# EAGLE design untitled (EAGLE 7.2.0)
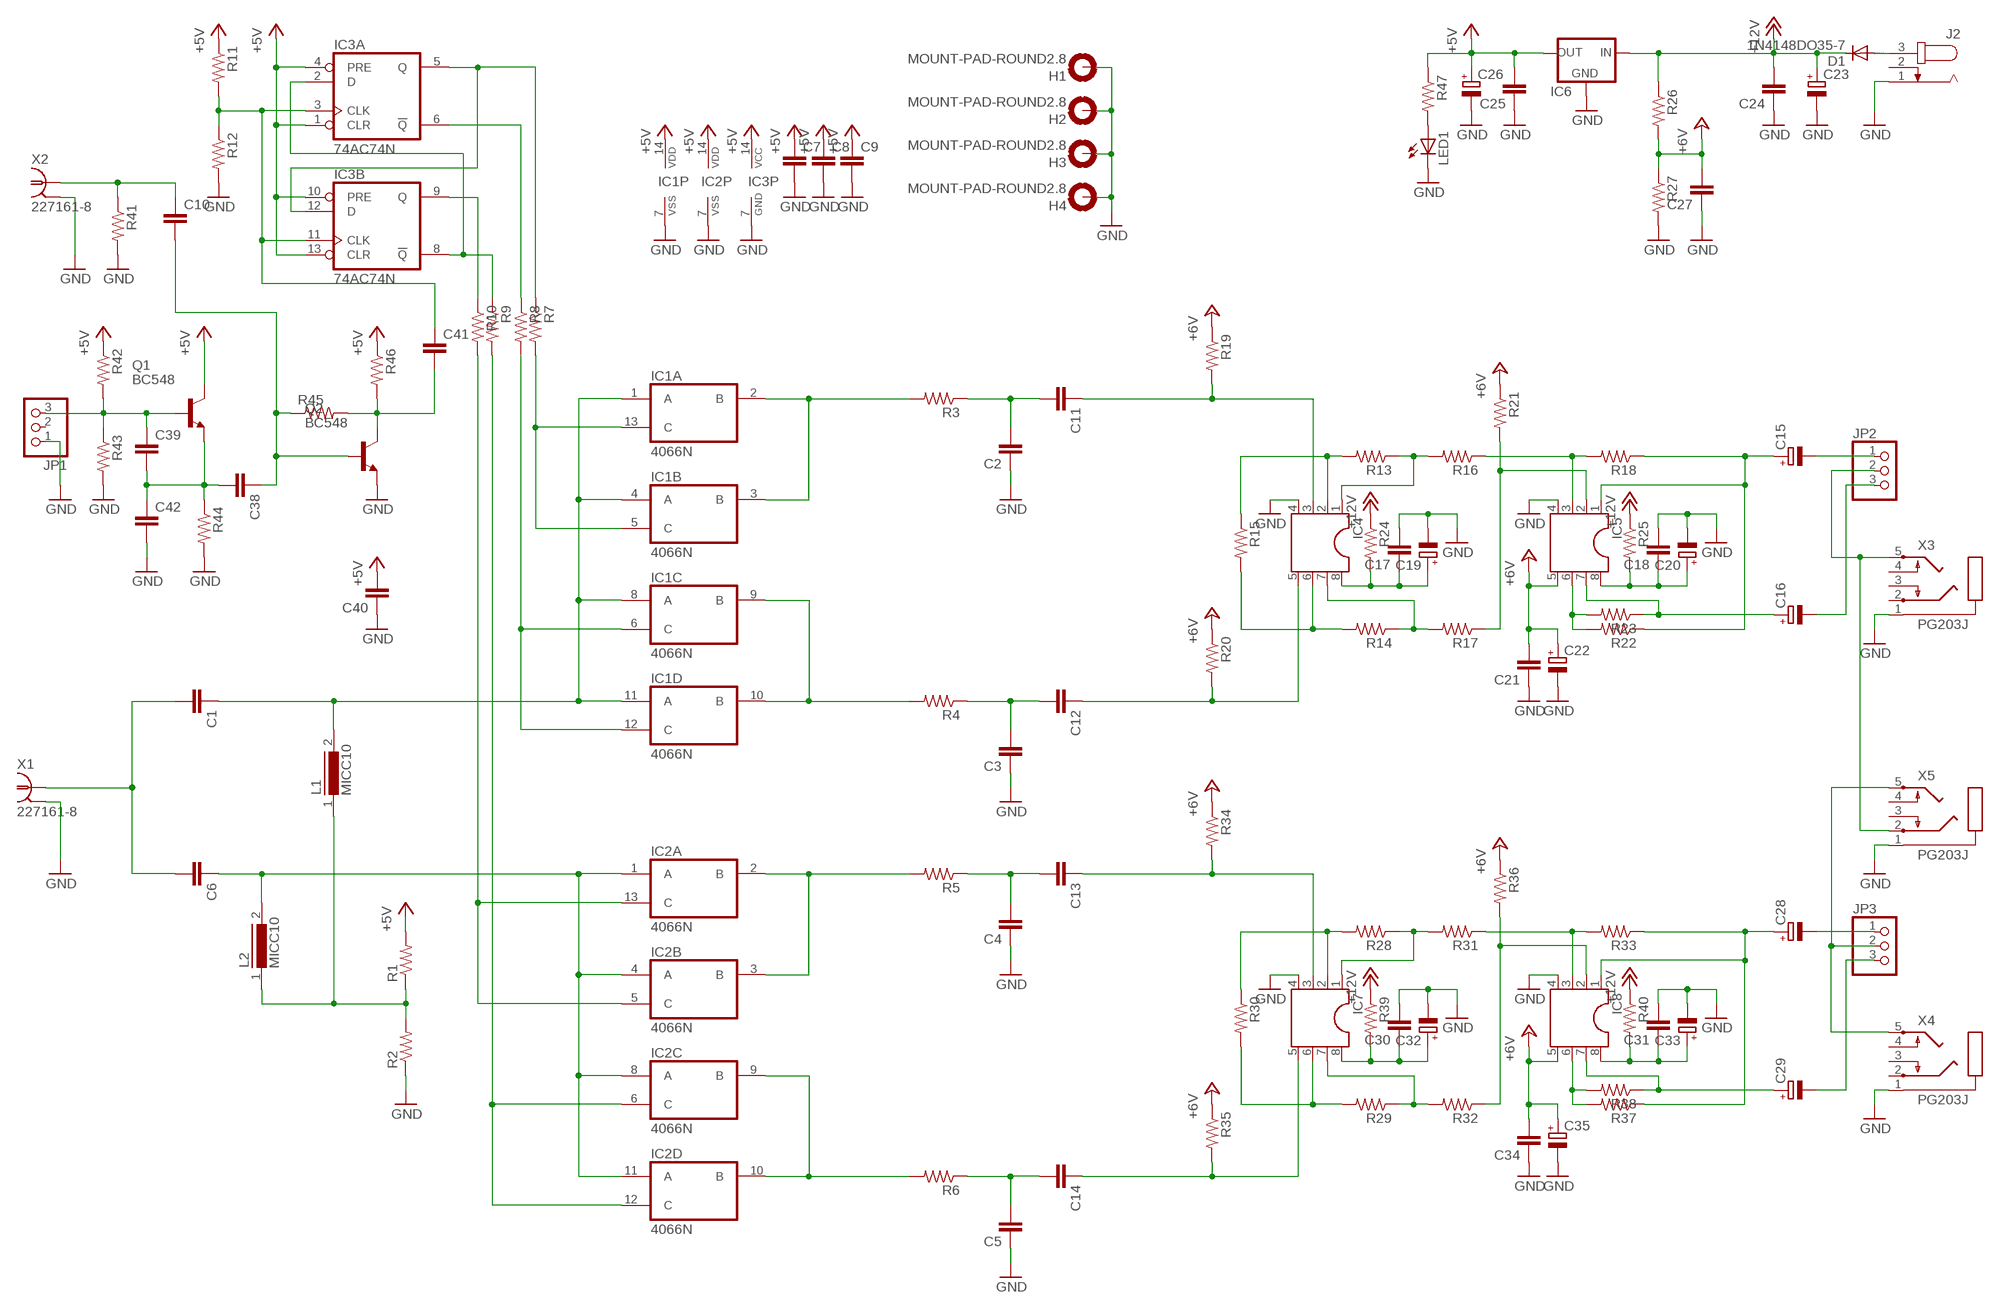
[diagram p0: schematic, sheet 1]

## Parts
C1  C-EU050-025X075  [C050-025X075]
C2  C-EU050-025X075  [C050-025X075]
C3  C-EU050-025X075  [C050-025X075]
C4  C-EU050-025X075  [C050-025X075]
C5  C-EU050-025X075  [C050-025X075]
C6  C-EU050-025X075  [C050-025X075]
C7  C-EU050-025X075  [C050-025X075]
C8  C-EU050-025X075  [C050-025X075]
C9  C-EU050-025X075  [C050-025X075]
C10  C-EU050-025X075  [C050-025X075]
C11  C-EU050-025X075  [C050-025X075]
C12  C-EU050-025X075  [C050-025X075]
C13  C-EU050-025X075  [C050-025X075]
C14  C-EU050-025X075  [C050-025X075]
C15  CPOL-EUE5-6  [E5-6]
C16  CPOL-EUE5-6  [E5-6]
C17  C-EU050-025X075  [C050-025X075]
C18  C-EU050-025X075  [C050-025X075]
C19  CPOL-EUE5-6  [E5-6]
C20  CPOL-EUE5-6  [E5-6]
C21  C-EU050-025X075  [C050-025X075]
C22  CPOL-EUE5-6  [E5-6]
C23  CPOL-EUE5-6  [E5-6]
C24  C-EU050-025X075  [C050-025X075]
C25  C-EU050-025X075  [C050-025X075]
C26  CPOL-EUE5-6  [E5-6]
C27  C-EU050-025X075  [C050-025X075]
C28  CPOL-EUE5-6  [E5-6]
C29  CPOL-EUE5-6  [E5-6]
C30  C-EU050-025X075  [C050-025X075]
C31  C-EU050-025X075  [C050-025X075]
C32  CPOL-EUE5-6  [E5-6]
C33  CPOL-EUE5-6  [E5-6]
C34  C-EU050-025X075  [C050-025X075]
C35  CPOL-EUE5-6  [E5-6]
C38  C-EU050-025X075  [C050-025X075]
C39  C-EU025-025X050  [C025-025X050]
C40  C-EU050-025X075  [C050-025X075]
C41  C-EU075-032X103  [C075-032X103]
C42  C-EU025-025X050  [C025-025X050]
D1  1N4148DO35-7  [DO35-7]
H1  MOUNT-PAD-ROUND2.8  [2,8-PAD]
H2  MOUNT-PAD-ROUND2.8  [2,8-PAD]
H3  MOUNT-PAD-ROUND2.8  [2,8-PAD]
H4  MOUNT-PAD-ROUND2.8  [2,8-PAD]
IC1  4066N  [DIL14]
IC2  4066N  [DIL14]
IC3  74AC74N  [DIL14]
IC4  DIL8  [DIL08]
IC5  DIL8  [DIL08]
IC6  78XXS  [78XXS]
IC7  DIL8  [DIL08]
IC8  DIL8  [DIL08]
J2  JACK-PLUG0  [SPC4077]
JP1  PINHD-1X3  [1X03]
JP2  PINHD-1X3  [1X03]
JP3  PINHD-1X3  [1X03]
L1  MICC10  [MICC10]
L2  MICC10  [MICC10]
LED1  LED3MM  [LED3MM]
Q1  BC548  [TO92-EBC]
Q2  BC548  [TO92-EBC]
R1  R-US_0207/7  [0207/7]
R2  R-US_0207/7  [0207/7]
R3  R-US_0207/7  [0207/7]
R4  R-US_0207/7  [0207/7]
R5  R-US_0207/7  [0207/7]
R6  R-US_0207/7  [0207/7]
R7  R-US_0207/7  [0207/7]
R8  R-US_0207/7  [0207/7]
R9  R-US_0207/7  [0207/7]
R10  R-US_0207/7  [0207/7]
R11  R-US_0207/7  [0207/7]
R12  R-US_0207/7  [0207/7]
R13  R-US_0207/7  [0207/7]
R14  R-US_0207/7  [0207/7]
R15  R-US_0207/7  [0207/7]
R16  R-US_0207/7  [0207/7]
R17  R-US_0207/7  [0207/7]
R18  R-US_0207/7  [0207/7]
R19  R-US_0207/7  [0207/7]
R20  R-US_0207/7  [0207/7]
R21  R-US_0207/7  [0207/7]
R22  R-US_0207/7  [0207/7]
R23  R-US_0207/7  [0207/7]
R24  R-US_0207/7  [0207/7]
R25  R-US_0207/7  [0207/7]
R26  R-US_0207/7  [0207/7]
R27  R-US_0207/7  [0207/7]
R28  R-US_0207/7  [0207/7]
R29  R-US_0207/7  [0207/7]
R30  R-US_0207/7  [0207/7]
R31  R-US_0207/7  [0207/7]
R32  R-US_0207/7  [0207/7]
R33  R-US_0207/7  [0207/7]
R34  R-US_0207/7  [0207/7]
R35  R-US_0207/7  [0207/7]
R36  R-US_0207/7  [0207/7]
R37  R-US_0207/7  [0207/7]
R38  R-US_0207/7  [0207/7]
R39  R-US_0207/7  [0207/7]
R40  R-US_0207/7  [0207/7]
R41  R-US_0207/7  [0207/7]
R42  R-US_0207/7  [0207/7]
R43  R-US_0207/7  [0207/7]
R44  R-US_0207/7  [0207/7]
R45  R-US_0207/7  [0207/7]
R46  R-US_0207/7  [0207/7]
R47  R-US_0207/7  [0207/7]
X1  227161-8  [AMP_227161]
X2  227161-8  [AMP_227161]
X3  PG203J  [PG203J]
X4  PG203J  [PG203J]
X5  PG203J  [PG203J]

## Nets
+5V: C7.1 C8.1 C9.1 C25.2 C26.+ C40.2 IC1.14(P:VDD) IC2.14(P:VDD) IC3.1(A:CLR) IC3.4(A:PRE) IC3.10(B:PRE) IC3.13(B:CLR) IC3.14(P:VCC) IC6.OUT Q1.C R1.2 R11.1 R42.1 R46.1 R47.1
+12V: C23.+ C24.2 D1.C IC6.IN R24.1 R25.1 R26.1 R39.1 R40.1
+24V: C21.2 C22.+ C27.2 C34.2 C35.+ IC5.5 IC8.5 R19.1 R20.1 R21.1 R26.2 R27.1 R34.1 R35.1 R36.1 ; supply symbol labelled +6V
GND: C2.1 C3.1 C4.1 C5.1 C7.2 C8.2 C9.2 C17.2 C18.2 C19.- C20.- C21.1 C22.- C23.- C24.1 C25.1 C26.- C27.1 C30.2 C31.2 C32.- C33.- C34.1 C35.- C40.1 C42.2 H1.B2,8(MOUNT) H2.B2,8(MOUNT) H3.B2,8(MOUNT) H4.B2,8(MOUNT) IC1.7(P:VSS) IC2.7(P:VSS) IC3.7(P:GND) IC4.4 IC5.4 IC6.GND IC7.4 IC8.4 J2.1 JP1.1 LED1.K(C) Q2.E R2.1 R12.2 R27.2 R41.2 R43.2 R44.2 X1.2 X2.2 X3.1 X4.1 X5.1
N$1: L1.1 L2.1 R1.1 R2.2
N$2: C1.2 C6.2 X1.1
N$3: C1.1 IC1.1(A:A) IC1.4(B:A) IC1.8(C:A) IC1.11(D:A) L1.2
N$4: C6.1 IC2.1(A:A) IC2.4(B:A) IC2.8(C:A) IC2.11(D:A) L2.2
N$5: IC1.9(C:B) IC1.10(D:B) R4.2
N$6: IC1.2(A:B) IC1.3(B:B) R3.2
N$7: IC2.2(A:B) IC2.3(B:B) R5.2
N$8: IC2.9(C:B) IC2.10(D:B) R6.2
N$9: IC1.5(B:C) IC1.13(A:C) R7.2
N$10: IC1.6(C:C) IC1.12(D:C) R8.2
N$11: IC2.5(B:C) IC2.13(A:C) R10.2
N$12: IC2.6(C:C) IC2.12(D:C) R9.2
N$13: C2.2 C11.2 R3.1
N$14: C3.2 C12.2 R4.1
N$15: C4.2 C13.2 R5.1
N$16: C5.2 C14.2 R6.1
N$17: IC3.2(A:D) IC3.8(B:!Q) R9.1
N$18: IC3.6(A:!Q) R8.1
N$19: IC3.5(A:Q) IC3.12(B:D) R7.1
N$20: IC3.9(B:Q) R10.1
N$21: C41.1 IC3.3(A:CLK) IC3.11(B:CLK) R11.2 R12.1
N$22: C11.1 IC4.3 R19.2
N$23: C12.1 IC4.5 R20.2
N$24: IC4.2 R13.2 R15.1
N$25: IC4.6 R14.2 R15.2
N$26: IC4.7 R14.1 R17.2
N$27: IC4.1 R13.1 R16.2
N$28: IC5.2 R17.1 R21.2
N$29: C15.+ IC5.1 R18.1 R22.1
N$30: IC5.3 R16.1 R18.2
N$31: IC5.6 R22.2 R23.2
N$32: C16.+ IC5.7 R23.1
N$33: C17.1 C19.+ IC4.8 R24.2
N$34: C18.1 C20.+ IC5.8 R25.2
N$35: D1.A J2.3
N$36: C10.1 R41.1 X2.1
N$37: C15.- JP2.1
N$38: C13.1 IC7.3 R34.2
N$39: C14.1 IC7.5 R35.2
N$40: IC7.2 R28.2 R30.1
N$41: IC7.6 R29.2 R30.2
N$42: IC7.7 R29.1 R32.2
N$43: IC7.1 R28.1 R31.2
N$44: IC8.3 R31.1 R33.2
N$45: IC8.2 R32.1 R36.2
N$46: C28.+ IC8.1 R33.1 R37.1
N$47: IC8.6 R37.2 R38.2
N$48: C29.+ IC8.7 R38.1
N$49: C30.1 C32.+ IC7.8 R39.2
N$50: C31.1 C33.+ IC8.8 R40.2
N$51: C16.- JP2.3
N$52: C28.- JP3.1
N$53: C29.- JP3.3
N$54: C39.1 JP1.3 Q1.B R42.2 R43.1
N$55: C38.2 C39.2 C42.1 Q1.E R44.1
N$56: JP2.2 X3.5 X5.2
N$57: C41.2 Q2.C R45.2 R46.2
N$58: C10.2 C38.1 Q2.B R45.1
N$59: LED1.A R47.2
N$60: JP3.2 X4.5 X5.5
Unconnected: J2.2 JP1.2 X3.2 X3.3 X3.4 X4.2 X4.3 X4.4 X5.3 X5.4

## Library data of the parts
C1-C14 C17 C18 C21 C24 C25 C27 C30 C31 C34 C38-C42 = rcl:C-EU: CAPACITOR, European symbol
C15 C16 C19 C20 C22 C23 C26 C28 C29 C32 C33 C35 = rcl:CPOL-EU: POLARIZED CAPACITOR, European symbol
D1 = diode:1N4148: DIODE high speed (Philips)
H1-H4 = holes:MOUNT-PAD-ROUND: MOUNTING PAD, round
IC1 IC2 = 40xx:4066: Quad bilateral ANALOG SWITCH
IC3 = 74xx-eu:74*74: Dual D type positive edge triggered FLIP FLOP, preset and clear
IC4 IC5 IC7 IC8 = ic-package:DIL8: Dual In Line / Socket
IC6 = v-reg:78XXS: VOLTAGE REGULATOR
J2 = con-jack:JACK-PLUG: DC POWER JACK Power Jack, DC, Right Angle, Through Hole, Rated 5A at 16VDC, PC Terminals Distributor: Farnell (www.Farnell.de) Drawing: 84N1161.pdf / 84N1162.pdf Manufacturer: SPC Technology (www.spctechnology.com) Type: SPC4077 / SPC 4078; OC_FARNELL: unknown; OC_NEWARK: unknown
JP1-JP3 = pinhead:PINHD-1X3: PIN HEADER
L1 L2 = inductors:MICC10: INDUCTOR
LED1 = led:LED: LED OSRAM: - CHIPLED LG R971, LG N971, LY N971, LG Q971, LY Q971, LO R971, LY R971 LH N974, LH R974 LS Q976, LO Q976, LY Q976 LO Q996 - Hyper CHIPLED LW Q18S LB Q993, LB Q99A, LB R99A - SideLED LS A670, LO A670, LY A670, LG A670, LP A670 LB A673, LV A673, LT A673, LW A673 LH A674 LY A675 LS A676, LA A676, LO A676, LY A676, LW A676 LS A679, LY A679, LG A679 - Hyper Micro SIDELED® LS Y876, LA Y876, LO Y876, LY Y876 LT Y87S - SmartLED LW L88C, LW L88S LB L89C, LB L89S, LG L890 LS L89K, LO L89K, LY L89K LS L896, LA L896, LO L896, LY L896 - TOPLED LS T670, LO T670, LY T670, LG T670, LP T670 LSG T670, LSP T670, LSY T670, LOP T670, LYG T670 LG T671, LOG T671, LSG T671 LB T673, LV T673, LT T673, LW T673 LH T674 LS T676, LA T676, LO T676, LY T676, LB T676, LH T676, LSB T676, LW T676 LB T67C, LV T67C, LT T67C, LS T67K, LO T67K, LY T67K, LW E67C LS E67B, LA E67B, LO E67B, LY E67B, LB E67C, LV E67C, LT E67C LW T67C LS T679, LY T679, LG T679 LS T770, LO T770, LY T770, LG T770, LP T770 LB T773, LV T773, LT T773, LW T773 LH T774 LS E675, LA E675, LY E675, LS T675 LS T776, LA T776, LO T776, LY T776, LB T776 LHGB T686 LT T68C, LB T68C - Hyper Mini TOPLED® LB M676 - Mini TOPLED Santana® LG M470 LS M47K, LO M47K, LY M47K Source: http://www.osram.convergy.de LUXEON: - LUMILED® LXK2-PW12-R00, LXK2-PW12-S00, LXK2-PW14-U00, LXK2-PW14-V00 LXK2-PM12-R00, LXK2-PM12-S00, LXK2-PM14-U00 LXK2-PE12-Q00, LXK2-PE12-R00, LXK2-PE12-S00, LXK2-PE14-T00, LXK2-PE14-U00 LXK2-PB12-K00, LXK2-PB12-L00, LXK2-PB12-M00, LXK2-PB14-N00, LXK2-PB14-P00, LXK2-PB14-Q00 LXK2-PR12-L00, LXK2-PR12-M00, LXK2-PR14-Q00, LXK2-PR14-R00 LXK2-PD12-Q00, LXK2-PD12-R00, LXK2-PD12-S00 LXK2-PH12-R00, LXK2-PH12-S00 LXK2-PL12-P00, LXK2-PL12-Q00, LXK2-PL12-R00 Source: www.luxeon.com KINGBRIGHT: KA-3528ASYC Source: www.kingbright.com
Q1 Q2 = transistor-npn:BC548*: NPN Transistor
R1-R47 = rcl:R-US_: RESISTOR, American symbol
X1 X2 = con-coax:?227161*: JACK, RIGHT ANGLE, 50 OHM, PCB, BNC Source: amp_227161.pdf; OC_FARNELL: unknown; OC_NEWARK: unknown
X3-X5 = con-hirschmann:PG203J: MIC/HEADPHONE JACK KS-S stereo microphone/headphone jack PG203JN (Schukat); OC_FARNELL: unknown; OC_NEWARK: unknown

## Board
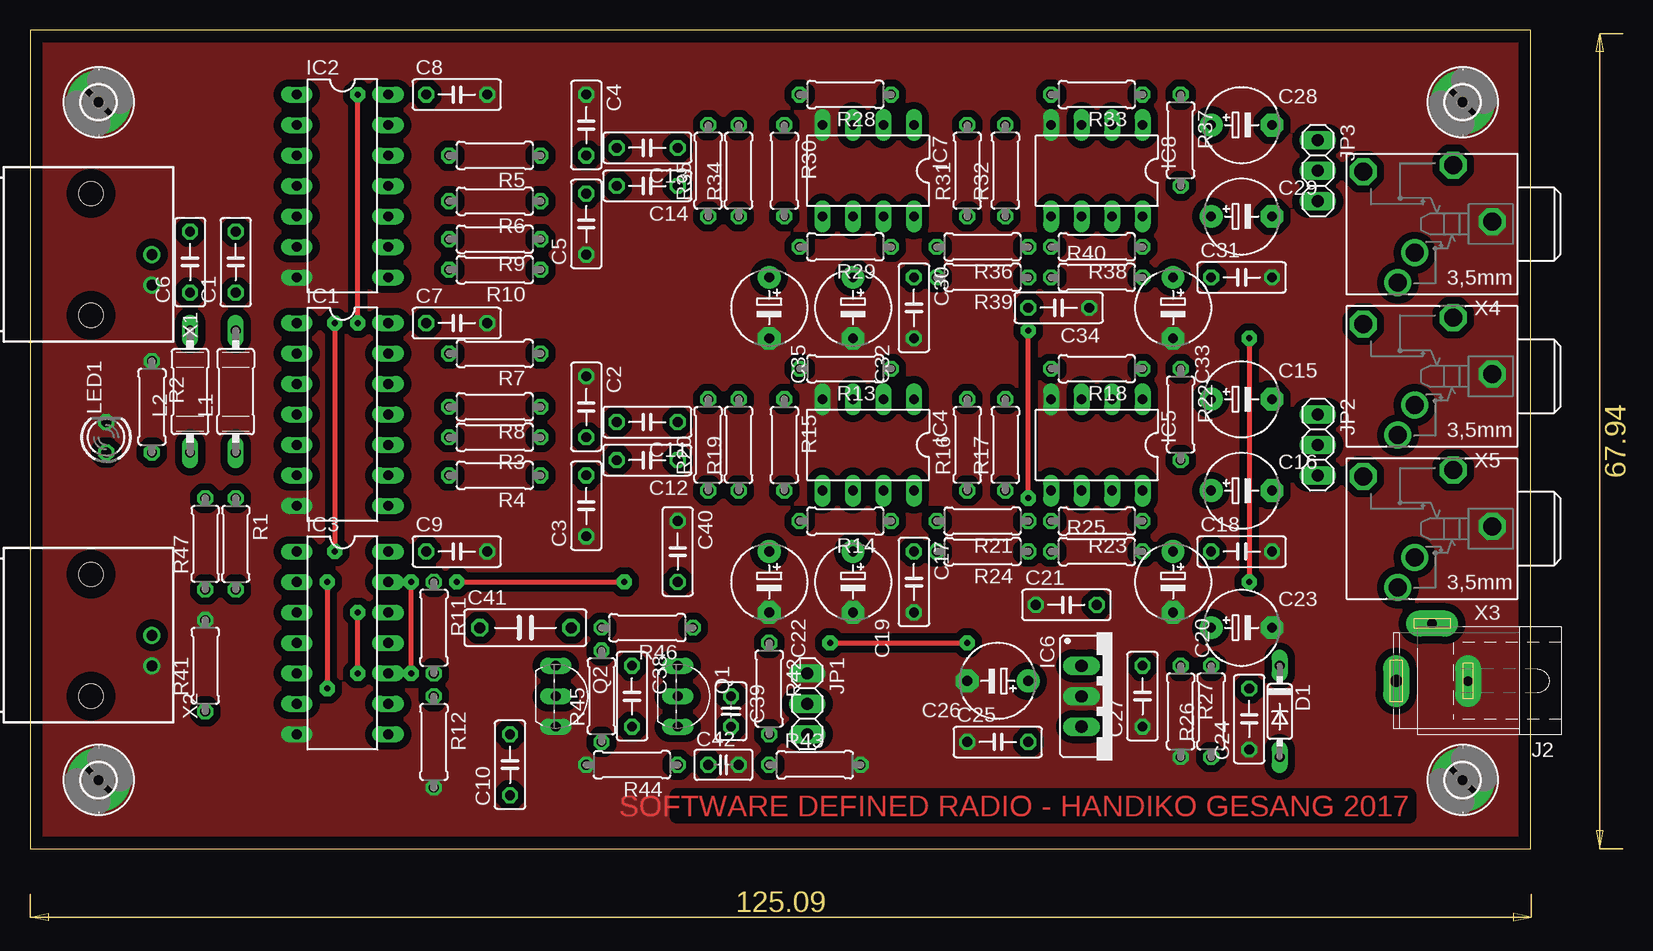
[diagram p1: board, top side]
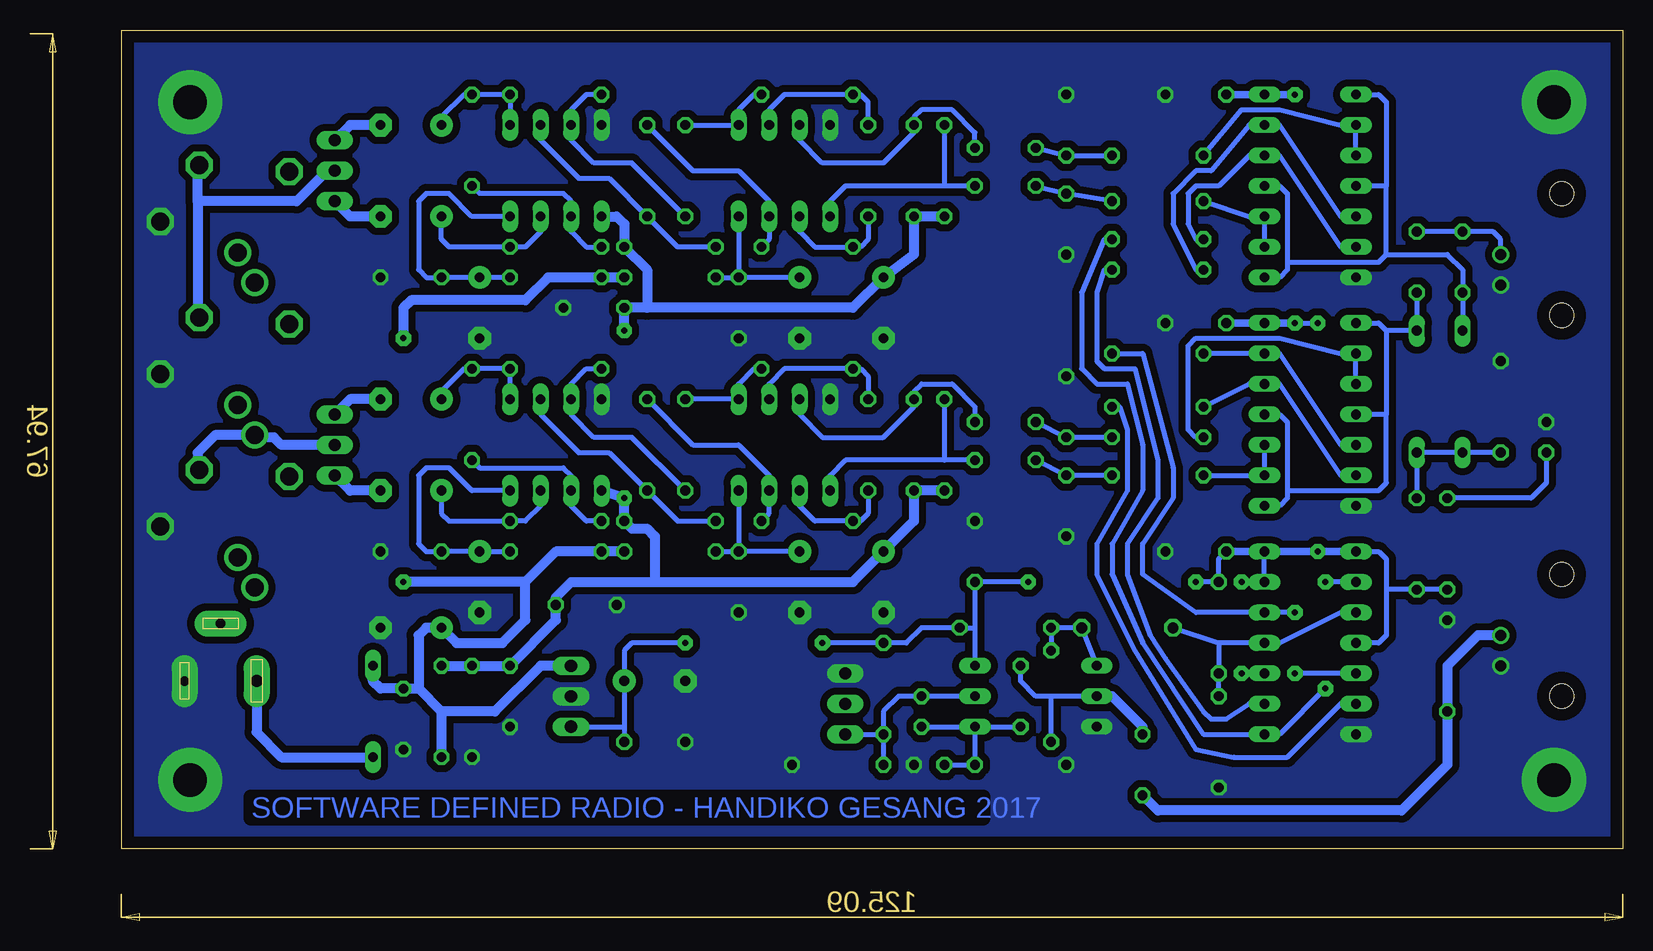
[diagram p2: board, bottom side, seen from below]

Size 125.08 x 68.25 mm. Coordinates in mm from the lower left corner, seen from the top.
Outline: 0,0 125.08,0 125.08,68.25 0,68.25 0,0
Copper layers (1*16): Top 0.035mm / dielectric 1.5mm / Bottom 0.035mm
Design rules "default *": minimum track width 10mil, minimum drill 10mil, track to track 8mil, track to pad 8mil, pad to pad 8mil, via to via 8mil, smd to smd 8mil, copper to edge 40mil, drill to drill 8mil, minimum pad ring 10mil, minimum via ring 10mil, stop-mask expansion 4mil, vias tented up to drill 0mil, thermal gap 10mil

### Footprints (pad centres in the part's own frame; a part is rotated, then mirrored left to right if it is on the bottom)
C050-025X075 = drill 0.813 octagon: 1 -2.54,0; 2 2.54,0
E5-6 = drill 0.813 pad 1.905: + -2.54,0 | drill 0.813 pad 1.905 octagon: - 2.54,0
C025-025X050 = drill 0.813 octagon: 1 -1.27,0; 2 1.27,0
C075-032X103 = drill 0.914 octagon: 1 -3.81,0; 2 3.81,0
DO35-7 = drill 0.813 long: A 3.81,0; C -3.81,0
2,8-PAD = drill 2.8 pad 5.334: B2,8 0,0
DIL14 = drill 0.813 long: 1 -7.62,-3.81; 2 -5.08,-3.81; 3 -2.54,-3.81; 4 0,-3.81; 5 2.54,-3.81; 6 5.08,-3.81; 7 7.62,-3.81; 8 7.62,3.81; 9 5.08,3.81; 10 2.54,3.81; 11 0,3.81; 12 -2.54,3.81; 13 -5.08,3.81; 14 -7.62,3.81
DIL08 = drill 0.813 long: 1 -3.81,-3.81; 2 -1.27,-3.81; 3 1.27,-3.81; 4 3.81,-3.81; 5 3.81,3.81; 6 1.27,3.81; 7 -1.27,3.81; 8 -3.81,3.81
78XXS = drill 1.016 long: GND 0,-2.54; IN -2.54,-2.54; OUT 2.54,-2.54
SPC4077 = drill 0.8 pad 2.184 long: 1 -3,0; 2 0,-4.8 | drill 1 pad 2.184 long: 3 3,0
1X03 = drill 1.016 long: 1 -2.54,0; 2 0,0; 3 2.54,0
MICC10 = drill 0.813 long: 1 -5.08,0; 2 5.08,0
LED3MM = drill 0.813 octagon: A -1.27,0; K 1.27,0
TO92-EBC = drill 0.813 long: B 0,-1.27; C -2.54,-1.27; E 2.54,-1.27
0207/7 = drill 0.813 octagon: 1 -3.81,0; 2 3.81,0
AMP_227161 = drill 0.9 pad 1.27: 1 0,-5.08; 2 -2.54,-5.08 | hole 2: -5.08,0; 5.08,0
PG203J = drill 1.499 octagon: 1 -5.004,-0.203; 4 5.74,-4.369; 5 -1.753,-4.902 | drill 1.499: 2 2.845,4.902; 3 1.448,2.388

### Placement (x,y rotation side)
C1  17.14,48.9 90 top
C2  46.35,36.83 270 top
C3  46.35,28.57 90 top
C4  46.35,60.33 270 top
C5  46.35,52.07 90 top
C6  13.34,48.9 90 top
C7  35.56,43.81 0 top
C8  35.56,62.87 0 top
C9  35.56,24.77 0 top
C10  40.01,6.99 90 top
C11  51.44,35.56 180 top
C12  51.44,32.38 180 top
C13  51.44,58.42 180 top
C14  51.44,55.24 180 top
C15  100.97,37.47 0 top
C16  100.97,29.84 0 top
C17  73.66,22.23 270 top
C18  100.97,24.77 0 top
C19  68.58,22.23 270 top
C20  95.25,22.23 270 top
C21  86.36,20.32 0 top
C22  61.59,22.23 270 top
C23  100.97,18.41 0 top
C24  101.6,10.79 90 top
C25  80.64,8.89 0 top
C26  80.64,13.97 180 top
C27  92.71,12.7 90 top
C28  100.97,60.33 0 top
C29  100.97,52.7 0 top
C30  73.66,45.09 270 top
C31  100.97,47.62 0 top
C32  68.58,45.09 270 top
C33  95.25,45.09 270 top
C34  85.72,45.09 180 top
C35  61.59,45.09 270 top
C38  50.16,12.7 270 top
C39  58.42,11.43 270 top
C40  53.98,24.77 270 top
C41  41.27,18.41 0 top
C42  57.78,6.99 0 top
D1  104.14,11.43 270 top
H1  119.38,5.71 0 top
H2  5.71,5.71 0 top
H3  5.71,62.23 0 top
H4  119.38,62.23 0 top
IC1  26.04,36.2 270 top
IC2  26.04,55.24 270 top
IC3  26.04,17.14 270 top
IC4  69.85,33.66 180 top
IC5  88.9,33.66 180 top
IC6  90.17,12.7 270 top
IC7  69.85,56.52 180 top
IC8  88.9,56.52 180 top
J2  116.84,13.97 180 top
JP1  64.77,12.06 270 top
JP2  107.31,33.66 270 top
JP3  107.31,56.52 270 top
L1  17.14,38.1 90 top
L2  13.34,38.1 90 top
LED1  6.35,34.29 90 top
Q1  55.24,12.7 270 top
Q2  45.09,12.7 270 top
R1  17.14,25.4 270 top
R2  10.16,36.83 270 top
R3  38.73,34.29 180 top
R4  38.73,31.11 180 top
R5  38.73,57.78 180 top
R6  38.73,53.98 180 top
R7  38.73,41.27 180 top
R8  38.73,36.83 180 top
R9  38.73,50.8 180 top
R10  38.73,48.26 180 top
R11  33.66,18.41 270 top
R12  33.66,8.89 270 top
R13  67.94,40.01 180 top
R14  67.94,27.3 180 top
R15  62.87,33.66 270 top
R16  78.11,33.66 90 top
R17  81.28,33.66 90 top
R18  88.9,40.01 180 top
R19  59.05,33.66 90 top
R20  56.52,33.66 90 top
R21  79.38,27.3 180 top
R22  95.89,36.2 270 top
R23  88.9,27.3 180 top
R24  79.38,24.77 180 top
R25  88.9,24.77 0 top
R26  98.42,11.43 90 top
R27  95.89,11.43 270 top
R28  67.94,62.87 180 top
R29  67.94,50.16 180 top
R30  62.87,56.52 270 top
R31  78.11,56.52 90 top
R32  81.28,56.52 90 top
R33  88.9,62.87 180 top
R34  59.05,56.52 90 top
R35  56.52,56.52 90 top
R36  79.38,50.16 180 top
R37  95.89,59.05 270 top
R38  88.9,50.16 180 top
R39  79.38,47.62 180 top
R40  88.9,47.62 0 top
R41  14.61,15.24 90 top
R42  61.59,13.34 270 top
R43  65.41,6.99 0 top
R44  50.16,6.99 180 top
R45  47.62,12.7 90 top
R46  51.44,18.41 180 top
R47  14.61,25.4 90 top
X1  5.08,49.53 90 top
X2  5.08,17.78 90 top
X3  116.84,26.67 180 top
X4  116.84,52.07 180 top
X5  116.84,39.37 180 top

### Tracks (layer width: path | path; a pad name or v marks a point on that pad's centre or on a via)
+5V  (via drill 0.5 pad 1.27)
  Top 0.406: v27.3,43.81 v27.3,62.87 | v31.75,14.61 v31.75,22.23 | v25.4,43.81 v25.4,24.77 | v66.67,17.14 v78.11,17.14 | v35.56,22.23 v49.53,22.23
  Bottom 0.406: IC3.14 IC3.13 v31.75,22.23 | IC3.10 v31.75,14.61 | C9.1 33.66,24.13 R11.1 v35.56,22.23 | v27.3,43.81 v25.4,43.81 | 53.98,18.41 C40.2 v49.53,22.23 | 53.98,18.41 Q1.C | 53.98,18.41 R46.1 58.42,18.41 59.69,17.14 R42.1 v66.67,17.14 | v78.11,17.14 82.55,17.14 83.19,16.51 C26.+ 83.19,10.16 | 83.19,10.16 C25.2 | IC6.OUT 83.19,10.16 | IC3.1 20.32,24.77 19.68,24.13 19.68,21.59 | 19.68,21.59 19.68,17.78 20.32,17.14 IC3.4 | R47.1 R1.2 19.68,21.59
  Bottom 0.61: C8.1 IC2.14 v27.3,62.87 | C7.1 IC1.14 v27.3,43.81 | IC3.1 v25.4,24.77 IC3.14 C9.1
+12V  (via drill 0.5 pad 1.27)
  Top 0.406: v101.6,42.55 v101.6,22.23
  Bottom 0.813: D1.C 104.14,13.97 103.5,13.34 C24.2 100.33,13.34 | 100.33,13.34 98.42,11.43 | 98.42,11.43 R26.1 | IC6.IN 90.17,15.24 93.98,11.43 98.42,11.43 | R24.1 R25.1 88.9,24.77 91.44,22.23 | 91.44,22.23 v101.6,22.23 | R39.1 R40.1 89.53,47.62 91.44,45.72 100.97,45.72 101.6,45.09 v101.6,42.55 | 100.33,13.34 100.33,17.78 99.69,18.41 C23.+ 97.16,17.14 93.34,17.14 91.44,19.05 91.44,22.23
+24V  (via drill 0.5 pad 1.27)
  Top 0.406: v83.19,29.21 v83.19,43.18
  Bottom 0.813: R20.1 R19.1 59.05,27.3 C22.+ 64.14,22.23 80.64,22.23 | 80.64,22.23 87.63,22.23 88.9,20.95 C21.2 88.9,19.05 C27.2 R27.1 R26.2 | 80.64,22.23 80.64,26.04 81.28,26.67 82.55,26.67 R21.1 v83.19,29.21 IC5.5 | v83.19,43.18 C34.2 81.28,45.09 | R35.1 R34.1 59.05,49.53 C35.+ 64.14,45.09 81.28,45.09 | IC8.5 83.82,52.7 83.19,52.07 R36.1 81.28,48.26 81.28,45.09
GND
  pour Bottom (isolate 0.6, no thermals): 0,67.94 125.09,67.94 125.09,0 0,0
  pour Top (isolate 0.61, no thermals): 0,67.94 125.09,67.94 125.09,0 0,0
N$1
  Bottom 0.406: R2.2 L2.1 L1.1 R1.1
N$2
  Bottom 0.406: X1.1 10.16,50.8 10.79,51.44 C6.2 C1.2
N$3
  Bottom 0.406: IC1.11 28.57,36.2 27.94,35.56 27.94,29.84 | 27.94,29.84 27.94,29.21 28.57,28.57 IC1.8 | IC1.1 20.32,43.81 19.68,43.18 | 19.68,43.18 19.68,36.2 | 19.68,36.2 IC1.4 | 27.94,29.84 20.32,29.84 19.68,30.48 19.68,36.2 | C1.1 L1.2 19.68,43.18
N$4
  Bottom 0.406: IC2.11 28.57,55.24 27.94,54.61 27.94,48.9 | 27.94,48.9 27.94,48.26 28.57,47.62 IC2.8 | IC2.1 20.32,62.87 19.68,62.23 19.68,55.24 | 19.68,55.24 IC2.4 | 27.94,48.9 20.32,48.9 19.68,49.53 | 19.68,49.53 19.68,55.24 | 19.68,49.53 14.61,49.53 13.34,48.26 C6.1 L2.2
N$5
  Bottom 0.406: IC1.10 IC1.9 R4.2
N$6
  Bottom 0.406: IC1.3 IC1.2 23.5,41.27 28.57,42.55 35.56,42.55 36.2,41.91 36.2,34.92 35.56,34.29 R3.2
N$7
  Bottom 0.406: IC2.3 IC2.2 23.5,60.33 28.57,61.59 31.75,61.59 R5.2
N$8
  Bottom 0.406: IC2.9 IC2.10 31.11,52.7 R6.2
N$9
  Bottom 0.406: R7.2 IC1.13 28.57,41.27 23.5,33.66 IC1.5
N$10
  Bottom 0.406: R8.2 31.11,38.73 IC1.12 28.57,38.73 23.5,31.11 IC1.6
N$11
  Bottom 0.406: R10.2 35.56,48.26 37.47,52.07 37.47,54.61 35.56,56.52 34.29,56.52 31.11,60.33 IC2.13 28.57,60.33 23.5,52.7 IC2.5
N$12
  Bottom 0.406: R9.2 35.56,50.8 36.2,52.07 36.2,54.61 35.56,55.24 33.66,55.24 31.11,57.78 IC2.12 28.57,57.78 23.5,50.16 IC2.6
N$13
  Bottom 0.406: R3.1 C2.2 C11.2
N$14
  Bottom 0.406: R4.1 C3.2 C12.2
N$15
  Bottom 0.406: C13.2 C4.2 R5.1
N$16
  Bottom 0.406: R6.1 C5.2 C14.2
N$17  (via drill 0.5 pad 1.27)
  Top 0.406: v24.77,22.23 v24.77,13.34
  Bottom 0.406: IC3.2 v24.77,22.23 | v24.77,13.34 28.57,9.53 IC3.8 34.92,9.53 40.01,17.14 42.55,22.86 42.55,25.4 40.01,29.84 40.01,33.66 41.27,38.73 43.81,38.73 45.09,40.01 45.09,46.35 43.18,50.8 R9.1
N$18
  Bottom 0.406: R8.1 41.91,36.83 41.27,34.92 41.27,29.84 43.81,25.4 43.81,22.86 40.64,16.51 35.56,8.26 32.38,7.62 27.94,7.62 23.5,12.06 IC3.6
N$19  (via drill 0.5 pad 1.27)
  Top 0.406: v27.3,14.61 v27.3,19.68
  Bottom 0.406: R7.1 40.01,41.27 37.47,31.75 37.47,29.21 40.01,25.4 40.01,22.86 35.56,19.68 IC3.12 v27.3,19.68 | IC3.5 v27.3,14.61
N$20
  Bottom 0.406: R10.1 43.18,48.26 43.81,46.35 43.81,40.64 43.18,40.01 40.64,40.01 38.73,32.38 38.73,29.21 41.27,25.4 41.27,22.86 39.37,17.78 38.1,15.88 34.92,11.43 34.29,10.79 33.02,10.79 31.11,12.06 IC3.9
N$21
  Bottom 0.406: R12.1 R11.2 33.66,17.14 | IC3.3 23.5,19.68 28.57,17.14 IC3.11 33.66,17.14 | C41.1 33.66,17.14
N$22
  Bottom 0.406: IC4.3 68.58,36.2 66.67,34.29 61.59,34.29 59.05,36.83 R19.2 59.05,38.1 58.42,38.73 55.88,38.73 53.98,36.83 C11.1
N$23
  Bottom 0.406: R20.2 56.52,32.38 | 56.52,32.38 64.77,32.38 66.04,31.11 IC4.5 | C12.1 56.52,32.38
N$24
  Bottom 0.406: IC4.2 71.12,38.73 69.85,40.01 R13.2 63.5,40.01 62.87,39.37 R15.1
N$25
  Bottom 0.406: R15.2 62.87,27.94 63.5,27.3 R14.2 67.31,27.3 68.58,28.57 IC4.6
N$26
  Bottom 0.406: R14.1 71.12,27.94 IC4.7 71.12,31.11 73.66,33.66 77.47,33.66 R17.2
N$27
  Bottom 0.406: R13.1 72.39,40.01 73.66,38.73 IC4.1 R16.2
N$28
  Bottom 0.406: IC5.2 90.17,36.2 87,33.02 84.45,33.02 R17.1 78.74,27.3 R21.2
N$29
  Bottom 0.406: IC5.1 R18.1 R22.1 96.52,40.01 98.42,38.1 C15.+
N$30
  Bottom 0.406: R18.2 86.36,40.01 87.63,38.73 IC5.3 87.63,36.2 85.72,34.29 82.55,34.29 R16.1
N$31
  Bottom 0.406: R22.2 95.25,31.75 88.27,31.75 87.63,31.11 IC5.6 87.63,28.57 86.36,27.3 R23.2
N$32
  Bottom 0.406: C16.+ 98.42,27.94 97.79,27.3 R23.1 91.44,27.3 90.17,28.57 IC5.7
N$33
  Bottom 0.406: IC4.8 C17.1 | C19.+ C17.1 | R24.2 C17.1
N$34
  Bottom 0.406: R25.2 C20.+ C18.1 99.69,24.77 100.33,25.4 100.33,31.11 99.69,31.75 97.79,31.75 95.89,29.84 IC5.8
N$35
  Bottom 0.813: J2.3 113.84,9.7 111.76,7.62 D1.A
N$36
  Bottom 0.813: X2.1 12.06,17.78 14.61,15.24 R41.1 14.61,6.99 18.41,3.17 38.73,3.17 C10.1
N$37
  Bottom 0.813: C15.- 106.05,37.47 JP2.1
N$38
  Bottom 0.406: IC7.3 68.58,59.05 66.67,57.15 61.59,57.15 59.05,59.69 R34.2 59.05,60.96 58.42,61.59 55.88,61.59 53.98,59.69 C13.1
N$39
  Bottom 0.406: C14.1 56.52,55.24 | 56.52,55.24 64.77,55.24 66.04,53.98 IC7.5 | R35.2 56.52,55.24
N$40
  Bottom 0.406: R30.1 62.87,62.23 63.5,62.87 R28.2 69.85,62.87 71.12,61.59 IC7.2
N$41
  Bottom 0.406: IC7.6 68.58,51.44 67.31,50.16 R29.2 63.5,50.16 62.87,50.8 R30.2
N$42
  Bottom 0.406: R29.1 71.12,50.8 IC7.7 71.12,53.98 73.66,56.52 77.47,56.52 R32.2
N$43
  Bottom 0.406: R28.1 72.39,62.87 73.66,61.59 IC7.1 R31.2
N$44
  Bottom 0.406: R31.1 82.55,57.15 85.72,57.15 87.63,59.05 IC8.3 87.63,61.59 86.36,62.87 R33.2
N$45
  Bottom 0.406: IC8.2 90.17,59.05 87,55.88 84.45,55.88 R32.1 78.74,50.16 R36.2
N$46
  Bottom 0.406: IC8.1 R33.1 R37.1 96.52,62.87 98.42,60.96 C28.+
N$47
  Bottom 0.406: R38.2 86.36,50.16 87.63,51.44 IC8.6 87.63,53.98 88.27,54.61 95.25,54.61 R37.2
N$48
  Bottom 0.406: IC8.7 90.17,51.44 91.44,50.16 R38.1 97.79,50.16 98.42,50.8 C29.+
N$49
  Bottom 0.406: IC7.8 C30.1 | R39.2 C30.1 | C32.+ C30.1
N$50
  Bottom 0.406: IC8.8 95.89,52.7 97.79,54.61 99.69,54.61 100.33,53.98 100.33,48.26 99.69,47.62 C31.1 C33.+ R40.2
N$51
  Bottom 0.813: C16.- 106.05,29.84 JP2.3
N$52
  Bottom 0.813: C28.- 106.05,60.33 JP3.1
N$53
  Bottom 0.813: C29.- 106.05,52.7 JP3.3
N$54
  Bottom 0.406: Q1.B C39.1 60.33,12.7 61.59,11.43 R42.2 | R42.2 R43.1 | JP1.3 R42.2
N$55
  Bottom 0.406: Q1.E C38.2 | Q1.E R44.1 C42.1 | C39.2 Q1.E
N$56
  Bottom 0.813: JP2.2 111.76,33.66 112.39,34.29 113.82,34.29 X5.2 117.3,34.47 118.75,33.02 118.75,31.73 X3.5
N$57
  Bottom 0.406: R45.2 R46.2 C41.2 Q2.C
N$58
  Bottom 0.406: Q2.B 47.62,12.7 | 47.62,12.7 48.9,12.7 50.16,13.97 C38.1 | R45.1 47.62,12.7
  Bottom 0.813: C10.2 40.01,10.16 42.55,12.7 Q2.B
N$59
  Bottom 0.406: LED1.A 6.35,30.48 7.62,29.21 R47.2
N$60
  Bottom 0.813: JP3.2 107.95,56.52 110.49,53.98 118.75,53.98 | 118.75,53.98 118.75,56.82 X4.5 | 118.75,53.98 118.75,44.42 X5.5

### Text on the board
Top: SOFTWARE DEFINED RADIO - HANDIKO GESANG 2017
Bottom: SOFTWARE DEFINED RADIO - HANDIKO GESANG 2017